# Altium schematic sheet IMX_Output Circuit.SchDoc
size A4; SheetNumber: 8; SheetTotal: 8
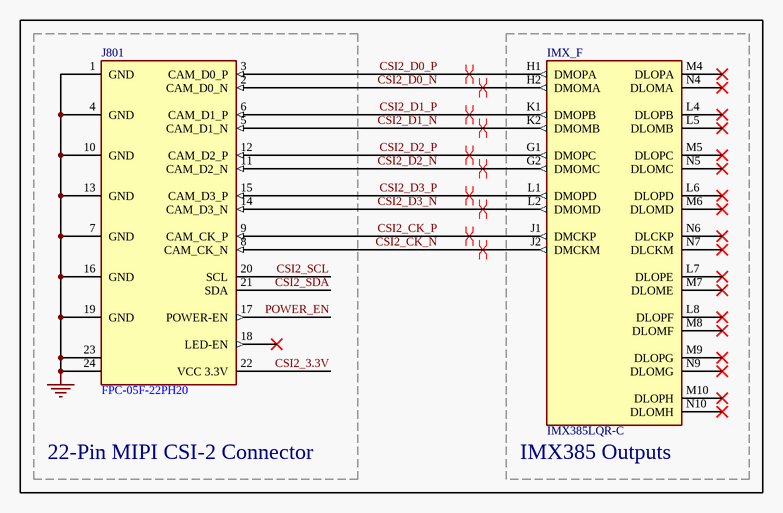
[diagram p0: IMX_Output Circuit.SchDoc]

## Parts
IMX_  IMX385LQR-C  [IMX385LQR]  (part F of 6)
J801  FPC-05F-22PH20  [FFC Connector]

## Blocks framed on the sheet
22-Pin MIPI CSI-2 Connector: J801
IMX385 Outputs: IMX_

## Nets
GND: J801.1(GND) J801.4(GND) J801.7(GND) J801.10(GND) J801.13(GND) J801.16(GND) J801.19(GND) J801.23 J801.24
CSI2_3.3V: J801.22(VCC_3.3V)
CSI2_CK_N: IMX_.J2(DMCKM) J801.8(CAM_CK_N)
CSI2_CK_P: IMX_.J1(DMCKP) J801.9(CAM_CK_P)
CSI2_D0_N: IMX_.H2(DMOMA) J801.2(CAM_D0_N)
CSI2_D0_P: IMX_.H1(DMOPA) J801.3(CAM_D0_P)
CSI2_D1_N: IMX_.K2(DMOMB) J801.5(CAM_D1_N)
CSI2_D1_P: IMX_.K1(DMOPB) J801.6(CAM_D1_P)
CSI2_D2_N: IMX_.G2(DMOMC) J801.11(CAM_D2_N)
CSI2_D2_P: IMX_.G1(DMOPC) J801.12(CAM_D2_P)
CSI2_D3_N: IMX_.L2(DMOMD) J801.14(CAM_D3_N)
CSI2_D3_P: IMX_.L1(DMOPD) J801.15(CAM_D3_P)
CSI2_SCL: J801.20(SCL)
CSI2_SDA: J801.21(SDA)
POWER_EN: J801.17(POWER-EN)

Not connected (* = marked no-connect by the designer): IMX_ L4(DLOPB)* L5(DLOMB)* L6(DLOPD)* L7(DLOPE)* L8(DLOPF)* M4(DLOPA)* M5(DLOPC)* M6(DLOMD)* M7(DLOME)* M8(DLOMF)* M9(DLOPG)* M10(DLOPH)* N4(DLOMA)* N5(DLOMC)* N6(DLCKP)* N7(DLCKM)* N9(DLOMG)* N10(DLOMH)*; J801 18(LED-EN)*

## Layout directives
differential pair; differential pair class D0: CSI2_D0_N, CSI2_D0_P
differential pair; differential pair class D1: CSI2_D1_N, CSI2_D1_P
differential pair; differential pair class D2: CSI2_D2_N, CSI2_D2_P
differential pair; differential pair class D3: CSI2_D3_N, CSI2_D3_P
differential pair; differential pair class DCK: CSI2_CK_N, CSI2_CK_P

## Library data of the parts
IMX_ = IMX385LQR
J801 = CSI-2 Connector: SMD,P=0.5mm,Surface Mount, Right Angle, #FPC-05F-22PH20, #C2856804